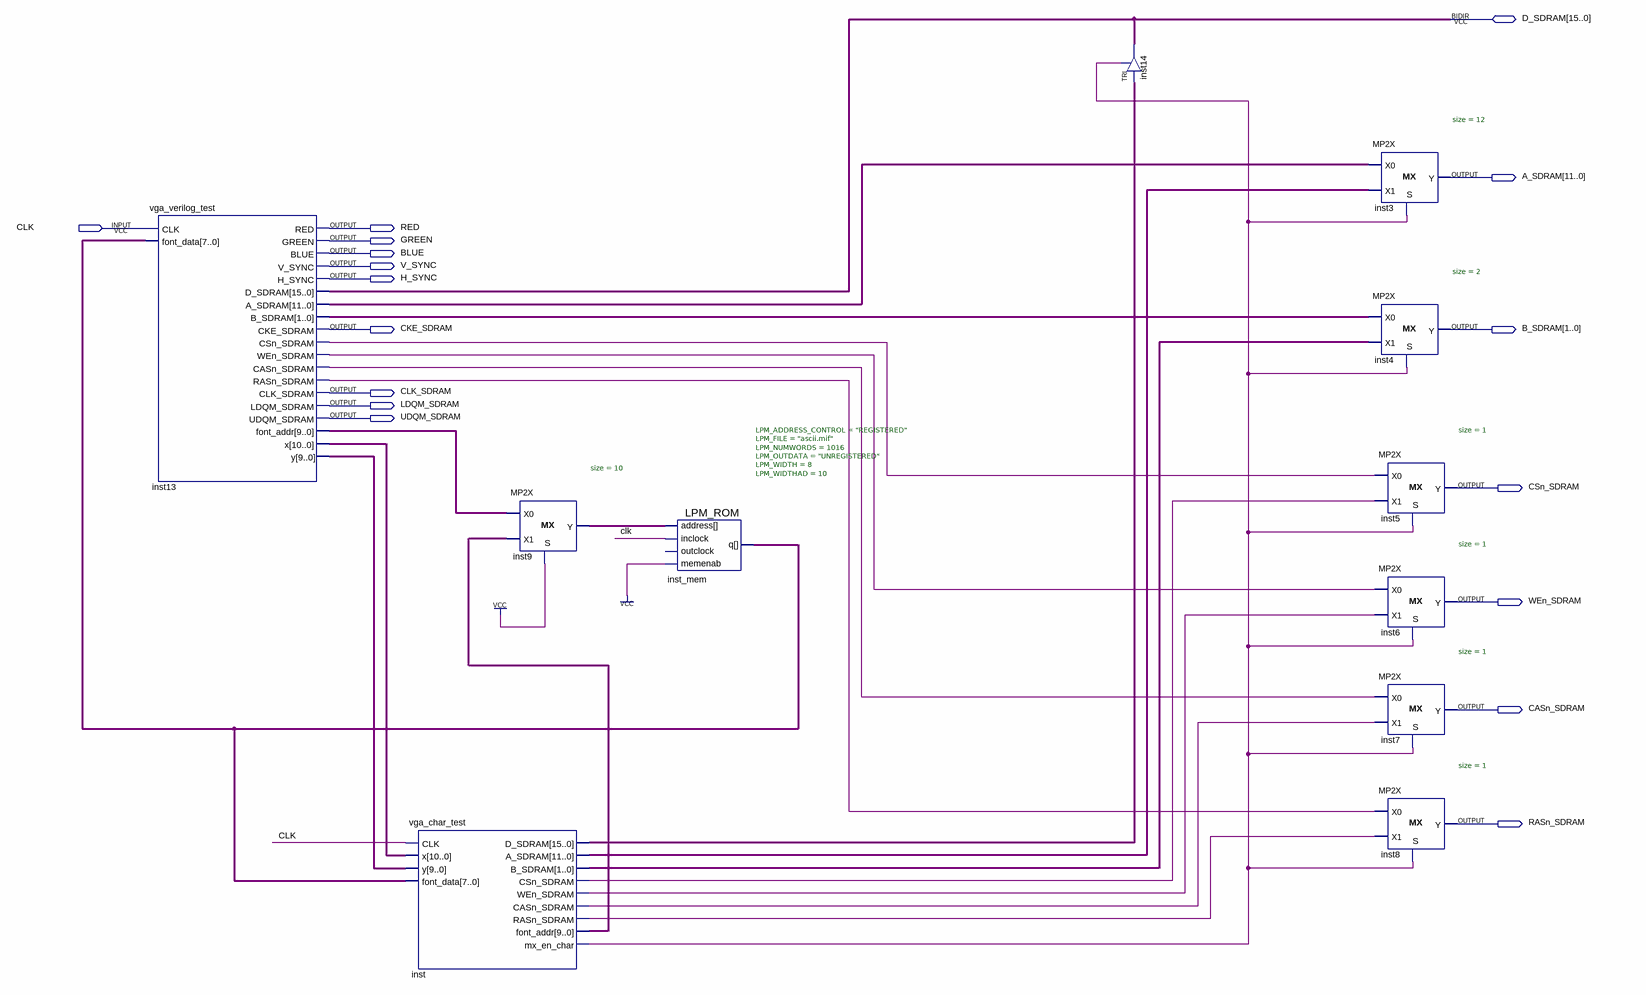
[diagram p0: schematic sheet]
// Quartus schematic bdf_vga_verilog_test.bdf as structural Verilog: 11 symbols, 17 pins
module bdf_vga_verilog_test (
  input  CLK,
  inout  [15:0] D_SDRAM,
  output [11:0] A_SDRAM,
  output RED,
  output GREEN,
  output BLUE,
  output V_SYNC,
  output H_SYNC,
  output CKE_SDRAM,
  output [1:0] B_SDRAM,
  output CLK_SDRAM,
  output LDQM_SDRAM,
  output UDQM_SDRAM,
  output CSn_SDRAM,
  output WEn_SDRAM,
  output CASn_SDRAM,
  output RASn_SDRAM
);

  wire inst13_casn_sdram, inst13_csn_sdram, inst13_rasn_sdram, inst13_wen_sdram, inst_casn_sdram,
       inst_csn_sdram, inst_mx_en_char, inst_rasn_sdram, inst_wen_sdram;
  wire [1:0] inst13_b_sdram, inst_b_sdram;
  wire [7:0] inst_mem_q;
  wire [9:0] inst9_y, inst13_font_addr, inst13_y, inst_font_addr;
  wire [10:0] inst13_x;
  wire [11:0] inst13_a_sdram, inst_a_sdram;
  wire [15:0] inst_d_sdram;

  vga_verilog_test inst13 (
    .CLK(CLK), .font_data(inst_mem_q), .RED(RED), .GREEN(GREEN), .BLUE(BLUE), .V_SYNC(V_SYNC),
    .H_SYNC(H_SYNC), .A_SDRAM(inst13_a_sdram), .B_SDRAM(inst13_b_sdram), .CKE_SDRAM(CKE_SDRAM),
    .CSn_SDRAM(inst13_csn_sdram), .WEn_SDRAM(inst13_wen_sdram), .CASn_SDRAM(inst13_casn_sdram),
    .RASn_SDRAM(inst13_rasn_sdram), .CLK_SDRAM(CLK_SDRAM), .LDQM_SDRAM(LDQM_SDRAM), .UDQM_SDRAM(UDQM_SDRAM),
    .font_addr(inst13_font_addr), .x(inst13_x), .y(inst13_y), .D_SDRAM(D_SDRAM));
  vga_char_test inst (
    .CLK(CLK), .x(inst13_x), .y(inst13_y), .font_data(inst_mem_q), .D_SDRAM(inst_d_sdram),
    .A_SDRAM(inst_a_sdram), .B_SDRAM(inst_b_sdram), .CSn_SDRAM(inst_csn_sdram), .WEn_SDRAM(inst_wen_sdram),
    .CASn_SDRAM(inst_casn_sdram), .RASn_SDRAM(inst_rasn_sdram), .font_addr(inst_font_addr),
    .mx_en_char(inst_mx_en_char));
  MP2X #(.size(10)) inst9 (.S(1'b1), .X0(inst13_font_addr), .X1(inst_font_addr), .Y(inst9_y));
  LPM_ROM #(.LPM_ADDRESS_CONTROL("REGISTERED"), .LPM_FILE("ascii.mif"), .LPM_NUMWORDS(1016), .LPM_OUTDATA("UNREGISTERED"), .LPM_WIDTH(8), .LPM_WIDTHAD(10)) inst_mem (
    .address(inst9_y), .inclock(CLK), .memenab(1'b1), .q(inst_mem_q));  // open: outclock
  TRI inst14[15:0] (.IN(inst_d_sdram), .OE(inst_mx_en_char), .OUT(D_SDRAM));
  MP2X #(.size(12)) inst3 (.S(inst_mx_en_char), .X0(inst13_a_sdram), .X1(inst_a_sdram), .Y(A_SDRAM));
  MP2X #(.size(2)) inst4 (.S(inst_mx_en_char), .X0(inst13_b_sdram), .X1(inst_b_sdram), .Y(B_SDRAM));
  MP2X #(.size(1)) inst5 (.S(inst_mx_en_char), .X0(inst13_csn_sdram), .X1(inst_csn_sdram), .Y(CSn_SDRAM));
  MP2X #(.size(1)) inst6 (.S(inst_mx_en_char), .X0(inst13_wen_sdram), .X1(inst_wen_sdram), .Y(WEn_SDRAM));
  MP2X #(.size(1)) inst7 (.S(inst_mx_en_char), .X0(inst13_casn_sdram), .X1(inst_casn_sdram), .Y(CASn_SDRAM));
  MP2X #(.size(1)) inst8 (.S(inst_mx_en_char), .X0(inst13_rasn_sdram), .X1(inst_rasn_sdram), .Y(RASn_SDRAM));
endmodule
